# Altium schematic sheet MotherBoard.SchDoc: Mother Board
size A4; ENG_APP_DATE: --/--/--; DSN_APP_DATE: --/--/--; CHK_APP_DATE: --/--/--; DocumentNumber: 1; SheetNumber: 1; SheetTotal: 16
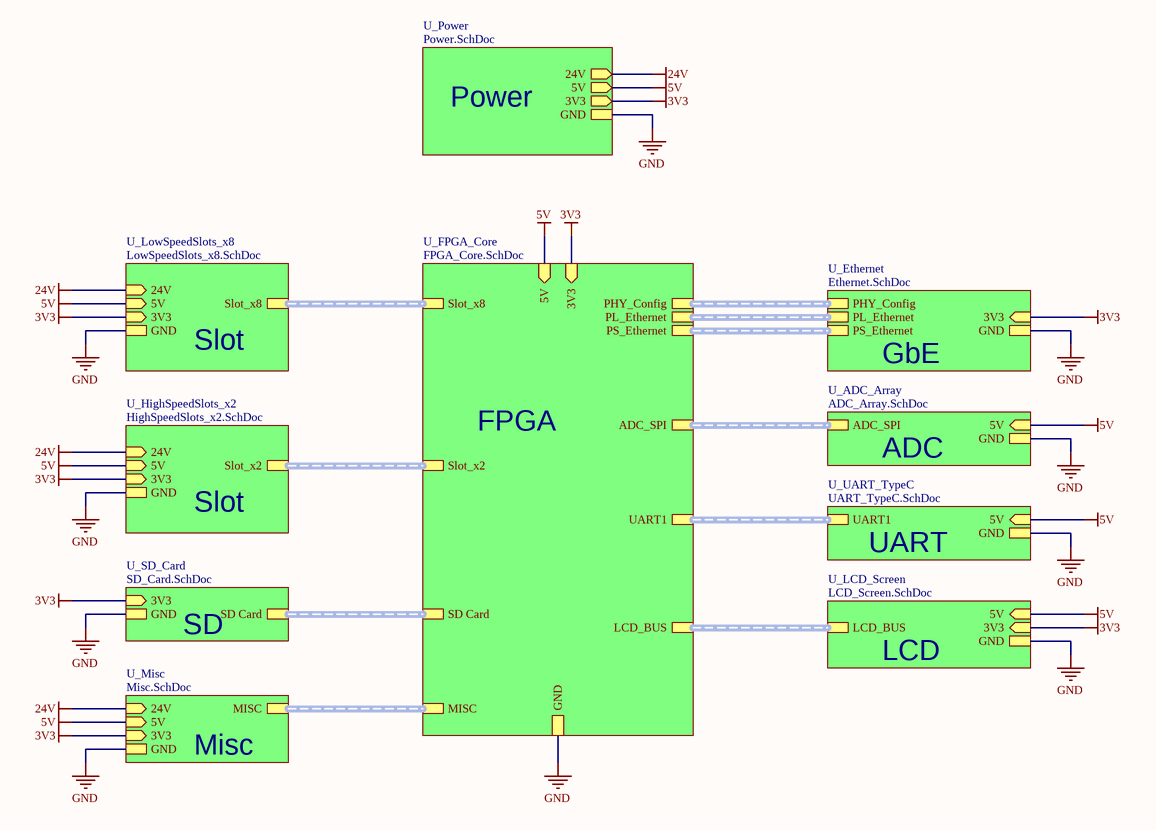
[diagram p0: MotherBoard.SchDoc]

## Sub-sheets
U_ADC_Array = ADC_Array.SchDoc: ADC_SPI (harness ADC SPI), 5V (in), GND
U_Ethernet = Ethernet.SchDoc: GND, 3V3 (in), PS_Ethernet, PHY_Config, PL_Ethernet
U_FPGA_Core = FPGA_Core.SchDoc: Slot_x2 (harness Slot x2), Slot_x8 (harness Slot x8), PHY_Config (harness PHY Config), PS_Ethernet (harness PS Ethernet), PL_Ethernet (harness PL Ethernet), 5V (in), GND, ADC_SPI (harness ADC SPI), 3V3 (in), UART1 (harness UART1), SD Card (harness SD CARD), LCD_BUS (harness LCD BUS), MISC (harness Misc)
U_HighSpeedSlots_x2 = HighSpeedSlots_x2.SchDoc: Slot_x2 (harness Slot x2), 24V (in), 5V (in), GND, 3V3 (in)
U_LCD_Screen = LCD_Screen.SchDoc: 3V3 (in), GND, LCD_BUS (harness LCD BUS), 5V (in)
U_LowSpeedSlots_x8 = LowSpeedSlots_x8.SchDoc: 24V (in), 5V (in), GND, Slot_x8 (harness Slot x8), 3V3 (in)
U_Misc = Misc.SchDoc: 3V3 (in), GND, MISC (harness Misc), 24V (in), 5V (in)
U_Power = Power.SchDoc: 24V (out), 5V (out), 3V3 (out), GND
U_SD_Card = SD_Card.SchDoc: SD Card (harness SD CARD), GND, 3V3 (in)
U_UART_TypeC = UART_TypeC.SchDoc: UART1 (harness UART1), 5V (in), GND

## Nets
3V3: sheet U_Power/3V3, sheet U_LowSpeedSlots_x8/3V3, sheet U_HighSpeedSlots_x2/3V3, sheet U_FPGA_Core/3V3, sheet U_Ethernet/3V3, sheet U_SD_Card/3V3, sheet U_LCD_Screen/3V3, sheet U_Misc/3V3
5V: sheet U_Power/5V, sheet U_LowSpeedSlots_x8/5V, sheet U_HighSpeedSlots_x2/5V, sheet U_FPGA_Core/5V, sheet U_ADC_Array/5V, sheet U_UART_TypeC/5V, sheet U_LCD_Screen/5V, sheet U_Misc/5V
24V: sheet U_Power/24V, sheet U_LowSpeedSlots_x8/24V, sheet U_HighSpeedSlots_x2/24V, sheet U_Misc/24V
GND: sheet U_Power/GND, sheet U_LowSpeedSlots_x8/GND, sheet U_HighSpeedSlots_x2/GND, sheet U_FPGA_Core/GND, sheet U_Ethernet/GND, sheet U_ADC_Array/GND, sheet U_UART_TypeC/GND, sheet U_SD_Card/GND, sheet U_LCD_Screen/GND, sheet U_Misc/GND

## Buses and harness runs
harness sheet U_ADC_Array/ADC_SPI = sheet U_FPGA_Core/ADC_SPI
harness sheet U_Ethernet/PHY_Config = sheet U_FPGA_Core/PHY_Config
harness sheet U_Ethernet/PL_Ethernet = sheet U_FPGA_Core/PL_Ethernet
harness sheet U_Ethernet/PS_Ethernet = sheet U_FPGA_Core/PS_Ethernet
harness sheet U_FPGA_Core/LCD_BUS = sheet U_LCD_Screen/LCD_BUS
harness sheet U_FPGA_Core/MISC = sheet U_Misc/MISC
harness sheet U_FPGA_Core/SD Card = sheet U_SD_Card/SD Card
harness sheet U_FPGA_Core/Slot_x2 = sheet U_HighSpeedSlots_x2/Slot_x2
harness sheet U_FPGA_Core/Slot_x8 = sheet U_LowSpeedSlots_x8/Slot_x8
harness sheet U_FPGA_Core/UART1 = sheet U_UART_TypeC/UART1

## Notes on the sheet
- Power
- Slot
- GbE
- FPGA
- ADC
- UART
- SD
- OLED
- LCD
- Misc
- Title
- FileName:
- Version:
- Date:
- Project
- Designed By:
- Descriptions:
- Sheet:
- of